# EAGLE design TSS_Rev3_Shield (EAGLE 7.3.0)
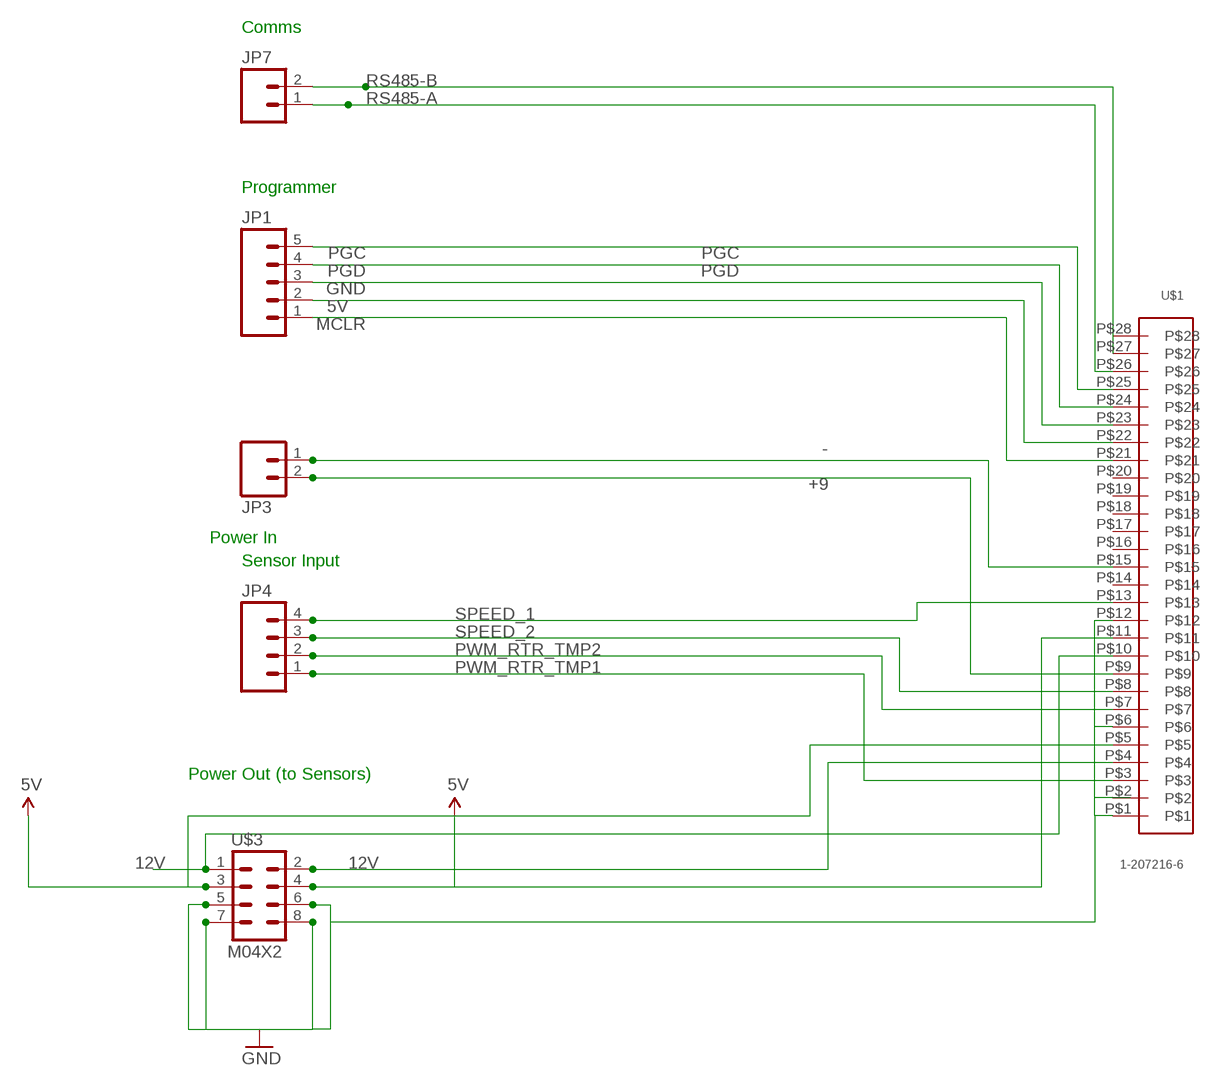
[diagram p0: schematic, sheet 1]

## Parts
JP1  M05PTH  [1X05]
JP3  M02LOCK  [1X02_LOCK]
JP4  M04PTH  [1X04]
JP7  M02PTH  [1X02]
U$1  1-207216-6  [1-207216-6]
U$3  M04X2  [2X4]

## Nets
5V: JP1.2 U$1.P$5 U$1.P$11 U$1.P$22 U$3.3 U$3.4
12V: U$1.P$4 U$1.P$10 U$3.1 U$3.2
+9: JP3.2 U$1.P$9
-: JP3.1 U$1.P$15
GND: JP1.3 U$1.P$1 U$1.P$6 U$1.P$12 U$1.P$23 U$3.5 U$3.6 U$3.7 U$3.8
MCLR: JP1.1 U$1.P$21
PGC: JP1.5 U$1.P$25
PGD: JP1.4 U$1.P$24
PWM_RTR_TMP1: JP4.1 U$1.P$3
PWM_RTR_TMP2: JP4.2 U$1.P$7
RS485-A: JP7.1 U$1.P$26
RS485-B: JP7.2 U$1.P$27
SPEED_1: JP4.4 U$1.P$13
SPEED_2: JP4.3 U$1.P$8
Unconnected: U$1.P$2 U$1.P$14 U$1.P$16 U$1.P$17 U$1.P$18 U$1.P$19 U$1.P$20 U$1.P$28

## Notes on the sheet
- Comms
- Programmer
- Power In
- Sensor Input
- Power Out (to Sensors)

## Library data of the parts
JP1 = SparkFun-Connectors:M05: Header 5 Standard 5-pin 0.1" header. Use with straight break away headers (SKU : PRT-00116), right angle break away headers (PRT-00553), swiss pins (PRT-00743), machine pins (PRT-00117), and female headers (PRT-00115). Molex polarized connector foot print use with SKU : PRT-08230 with associated crimp pins and housings.
JP3 JP7 = SparkFun-Connectors:M02: Standard 2-pin 0.1" header. Use with - straight break away headers ( PRT-00116) - right angle break away headers (PRT-00553) - swiss pins (PRT-00743) - machine pins (PRT-00117) - female headers (PRT-00115) Molex polarized connector foot print use with: PRT-08233 with associated crimp pins and housings. 2.54_SCREWTERM for use with PRT-10571. 3.5mm Screw Terminal footprints for PRT-08084 5mm Screw Terminal footprints for use with PRT-08432
JP4 = SparkFun-Connectors:M04: Header 4 Standard 4-pin 0.1" header. Use with straight break away headers (SKU : PRT-00116), right angle break away headers (PRT-00553), swiss pins (PRT-00743), machine pins (PRT-00117), and female headers (PRT-00115). Molex polarized connector foot print use with SKU : PRT-08231 with associated crimp pins and housings. 1MM SMD Version SKU: PRT-10208
U$1 = FSAE Electric:1-207216-6: TE 28 Pin Recepticle to board connector; PARTNO: 1-207216-6
U$3 = SparkFun-Connectors:M04X2: .1" header, two rows of four.

## Board
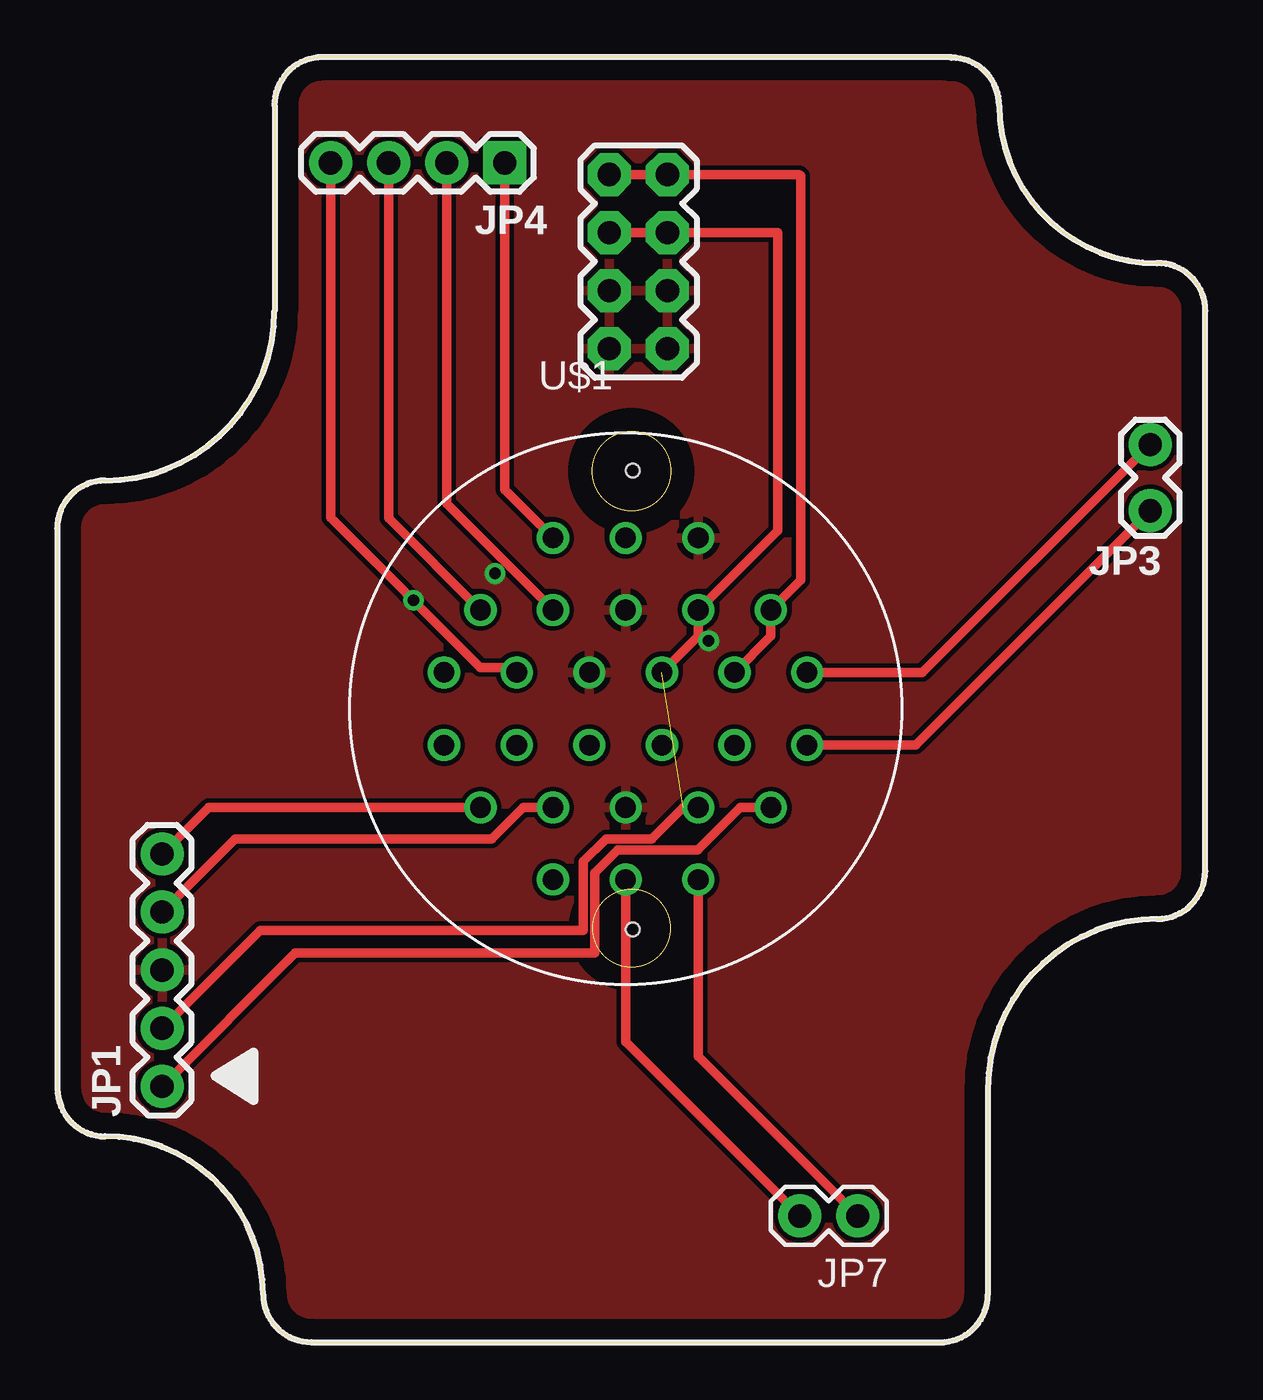
[diagram p1: board, top side]
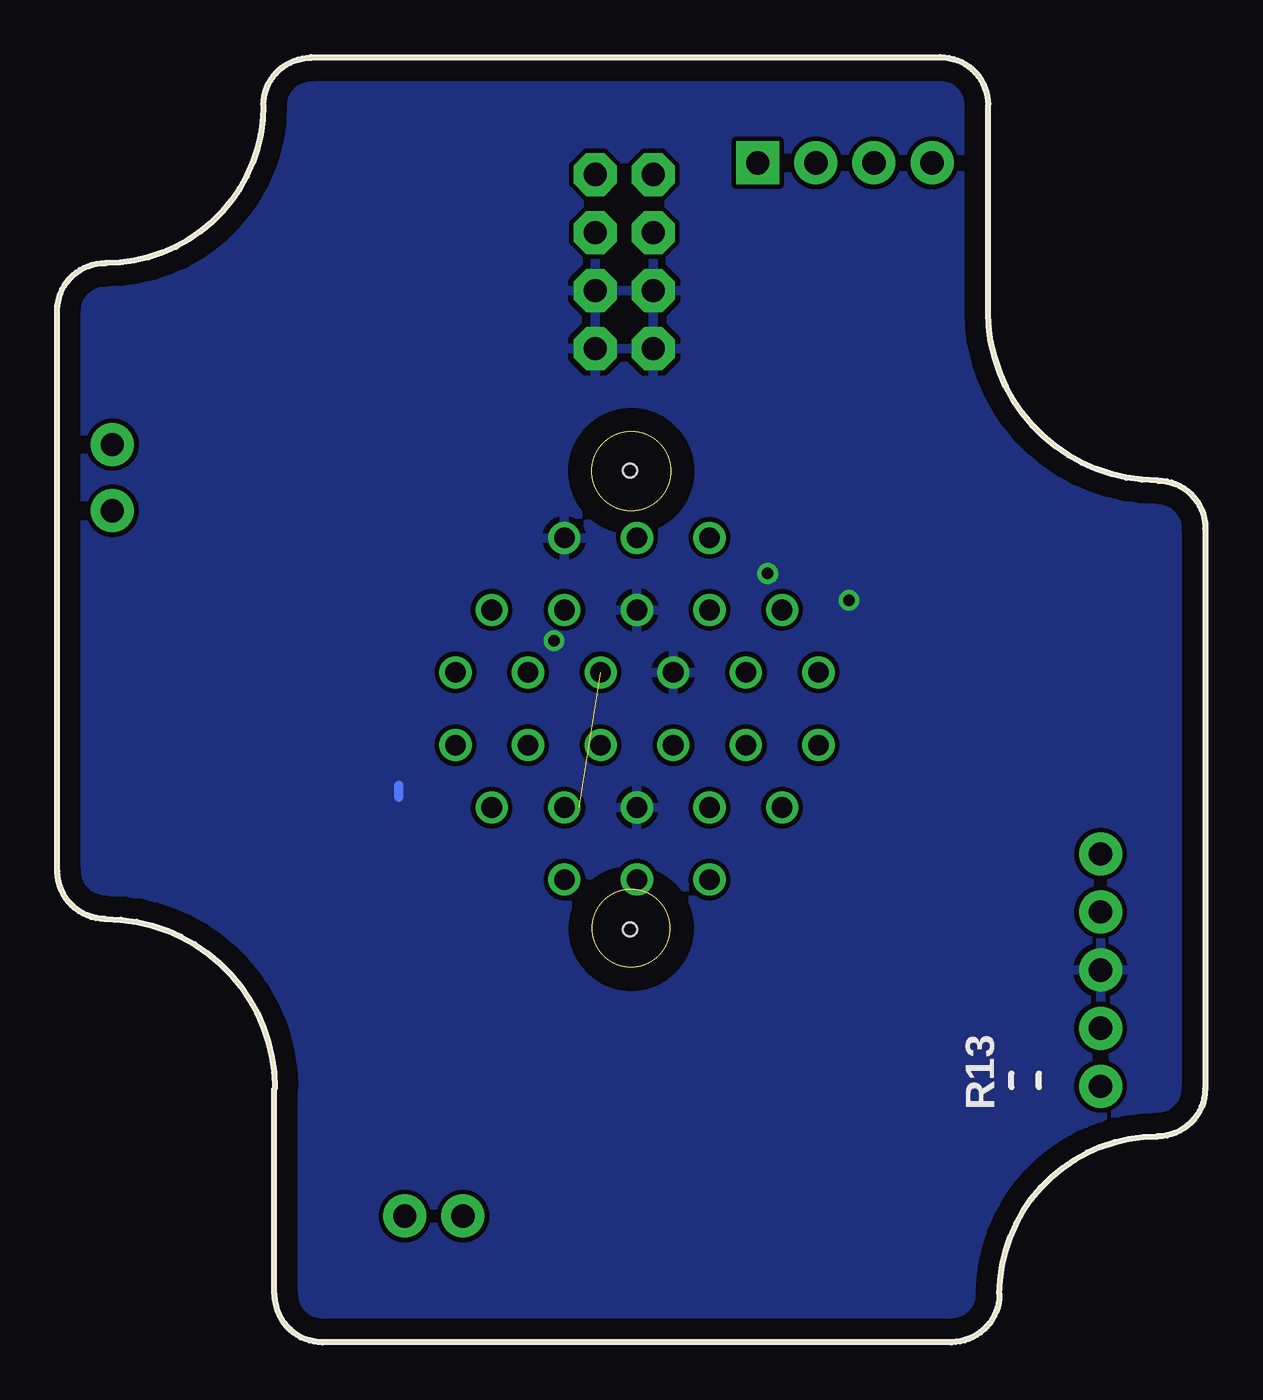
[diagram p2: board, bottom side, seen from below]

Size 50.2 x 56.21 mm. Coordinates in mm from the lower left corner, seen from the top.
Outline: 50.2,20.6 50.2,45.11 arc90 48.09,47.21
Outline: 40.7,2.11 40.7,11.1
Outline: 11.11,0 38.6,0 arc90 40.69,2.11
Outline: 0.01,35.61 0.01,11.1 arc90 2.1,9
Outline: 9.51,54.1 9.51,45.11
Outline: 39.1,56.21 11.59,56.21 arc90 9.5,54.1
Outline: 50.19,20.6 arc-90 48.09,18.52 arc90 40.69,11.1
Outline: 11.11,0.01 arc-90 9,2.11 arc90 2.1,9.02
Outline: 0,35.61 arc-90 2.1,37.69 arc90 9.5,45.11
Outline: 39.1,56.18 arc-90 41.19,54.1 arc90 48.09,47.19
Outline: circle at 25.11,18.11 radius 1.7
Outline: circle at 25.11,38.1 radius 1.73
Copper layers (1*16): Top 0.035mm / dielectric 1.5mm / Bottom 0.035mm
Design rules "default": minimum track width 10mil, minimum drill 24mil, track to track 8mil, track to pad 8mil, pad to pad 8mil, via to via 8mil, smd to smd 8mil, copper to edge 40mil, drill to drill 8mil, minimum pad ring 10mil, minimum via ring 8mil, stop-mask expansion 4mil, vias tented up to drill 0mil, thermal gap 10mil
Holes 0.6 mm at 25.16,38.13 25.16,18.06

### Footprints (pad centres in the part's own frame; a part is rotated, then mirrored left to right if it is on the bottom)
1X05 = drill 1.016 pad 1.88: 1 0,0; 2 2.54,0; 3 5.08,0; 4 7.62,0; 5 10.16,0
1X02_LOCK = drill 1.016 pad 1.88: 1 -0.178,0; 2 2.718,0
1X04 = drill 1.016 pad 1.88 square: 1 0,0 | drill 1.016 pad 1.88: 2 2.54,0; 3 5.08,0; 4 7.62,0
1X02 = drill 1.016 pad 1.88: 1 0,0; 2 2.54,0
1-207216-6 = drill 0.9: P$1 3.175,7.468; P$2 0,7.468; P$3 -3.175,7.468; P$4 6.35,4.318; P$5 3.175,4.318; P$6 0,4.318; P$7 -3.175,4.318; P$8 -6.35,4.318; P$9 7.938,1.587; P$10 4.763,1.587; P$11 1.587,1.587; P$12 -1.587,1.587; P$13 -4.763,1.587; P$14 -7.938,1.587; P$15 7.938,-1.587; P$16 4.763,-1.587; P$17 1.587,-1.587; P$18 -1.587,-1.587; P$19 -4.763,-1.587; P$20 -7.938,-1.587; P$21 6.35,-4.318; P$22 3.175,-4.318; P$23 0,-4.318; P$24 -3.175,-4.318; P$25 -6.35,-4.318; P$26 3.175,-7.468; P$27 0,-7.468; P$28 -3.175,-7.468
2X4 = drill 1.016 pad 1.88 octagon: 1 -3.81,-1.27; 2 -3.81,1.27; 3 -1.27,-1.27; 4 -1.27,1.27; 5 1.27,-1.27; 6 1.27,1.27; 7 3.81,-1.27; 8 3.81,1.27

### Placement (x,y rotation side)
JP1  4.58,11.2 90 top
JP3  47.79,36.55 90 top
JP4  19.57,51.59 180 top
JP7  35,5.53 180 top
U$1  24.85,27.71 0 top
U$3  25.41,47.27 270 top

### Tracks (layer width: path | path; a pad name or v marks a point on that pad's centre or on a via)
5V  (1 unrouted)
  Top 0.406: U$1.P$22 27.37,23.39 26,22.03 24,22.03 23,21.03 23,18.03 8.87,18.03 JP1.2 | U$3.3 U$3.4 31.49,48.54 31.5,48.53 31.5,35.51 U$1.P$5 28.03,30.89 U$1.P$11
12V
  Top 0.406: U$1.P$10 31.2,30.89 U$1.P$4 32.5,33.33 32.5,51.03 32.45,51.08 U$3.2 U$3.1
+9
  Top 0.406: U$1.P$9 37.82,29.3 JP3.2
-
  Top 0.406: U$1.P$15 37.54,26.12 JP3.1
GND  (via drill 0.5)
  Bottom 0.406: 35.27,24.36 35.27,23.85
  other vias: 19.14,33.63 15.58,32.46 28.49,30.68
  pour Bottom: -0.5,0.79 -0.5,56.16 49.8,56.16 49.7,-0.03
  pour Top: 10.17,0.03 8.39,1.8 8.39,5.11 8.14,5.36 5.35,8.15 2.04,8.15 0.01,10.19 0.01,36.86 0.77,37.62 4.08,37.62 8.65,42.19 8.65,44.22 9.41,44.98 9.41,54.64 10.68,55.91 40.4,55.91 40.4,55.4 41.67,54.13 41.67,52.1 41.67,51.08 43.95,48.79 44.21,48.79 45.48,47.52 48.27,47.52 50.56,45.24 50.56,20.6 48.53,18.57 45.99,18.57 44.72,17.3 44.46,17.3 42.18,15.01 41.92,15.01 40.91,14 40.91,0.28 40.65,0.03
MCLR
  Top 0.406: U$1.P$21 29.87,23.39 28,21.53 24.5,21.53 23.5,20.53 23.5,17.03 10.41,17.03 JP1.1
PGC
  Top 0.406: U$1.P$25 6.62,23.39 JP1.5
PGD
  Top 0.406: U$1.P$24 20.37,23.39 19,22.03 7.79,22.03 JP1.4
PWM_RTR_TMP1
  Top 0.406: JP4.1 19.57,37.29 U$1.P$3
PWM_RTR_TMP2
  Top 0.406: JP4.2 17.03,36.68 U$1.P$7
RS485-A
  Top 0.406: U$1.P$26 28.03,12.5 JP7.1
RS485-B
  Top 0.406: U$1.P$27 24.85,13.14 JP7.2
SPEED_1
  Top 0.406: JP4.4 11.95,36.08 18.5,29.53 19.86,29.53 U$1.P$13
SPEED_2
  Top 0.406: JP4.3 14.49,36.04 U$1.P$8

### Text on the board
_tsilk: JP4 | JP3 | JP1
_bsilk: R13